# Altium schematic sheet ECG_mesurment.SchDoc
size 594 x 420 mm; SheetNumber: 2; SheetTotal: 4
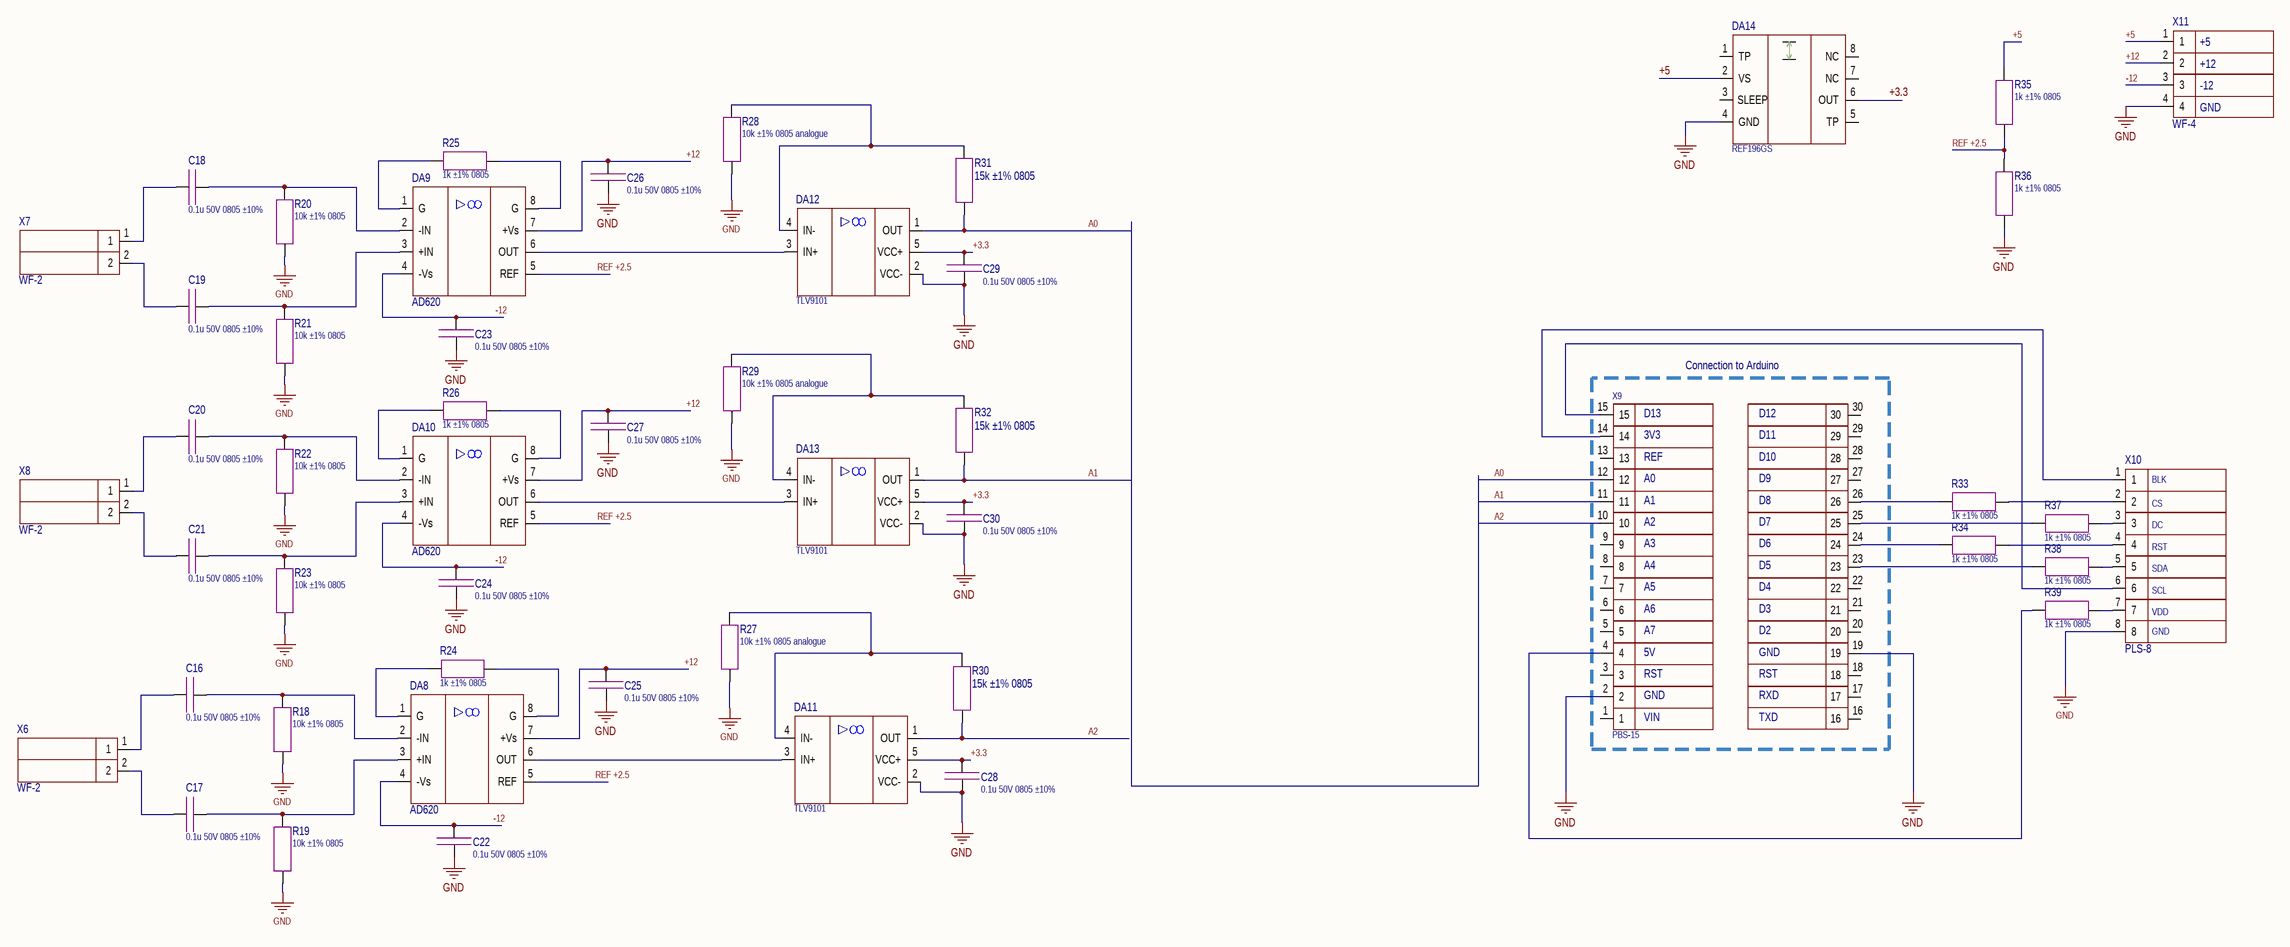
[diagram p0: ECG_mesurment.SchDoc]

## Parts
C16  0.1u 50V 0805 ±10%  [CAP: SMD 0805 MD IPC 782]
C17  0.1u 50V 0805 ±10%  [CAP: SMD 0805 MD IPC 782]
C18  0.1u 50V 0805 ±10%  [CAP: SMD 0805 MD IPC 782]
C19  0.1u 50V 0805 ±10%  [CAP: SMD 0805 MD IPC 782]
C20  0.1u 50V 0805 ±10%  [CAP: SMD 0805 MD IPC 782]
C21  0.1u 50V 0805 ±10%  [CAP: SMD 0805 MD IPC 782]
C22  0.1u 50V 0805 ±10%  [CAP: SMD 0805 MD IPC 782]
C23  0.1u 50V 0805 ±10%  [CAP: SMD 0805 MD IPC 782]
C24  0.1u 50V 0805 ±10%  [CAP: SMD 0805 MD IPC 782]
C25  0.1u 50V 0805 ±10%  [CAP: SMD 0805 MD IPC 782]
C26  0.1u 50V 0805 ±10%  [CAP: SMD 0805 MD IPC 782]
C27  0.1u 50V 0805 ±10%  [CAP: SMD 0805 MD IPC 782]
C28  0.1u 50V 0805 ±10%  [CAP: SMD 0805 MD IPC 782]
C29  0.1u 50V 0805 ±10%  [CAP: SMD 0805 MD IPC 782]
C30  0.1u 50V 0805 ±10%  [CAP: SMD 0805 MD IPC 782]
DA8  AD620  [IC: SOIC 8]
DA9  AD620  [IC: SOIC 8]
DA10  AD620  [IC: SOIC 8]
DA11  TLV9101  [IC: SOT 23 5pin]
DA12  TLV9101  [IC: SOT 23 5pin]
DA13  TLV9101  [IC: SOT 23 5pin]
DA14  REF196GS  [IC: SOIC 8]
R18  10k ±1% 0805  [RES: SMD 0805 MD IPC 782]
R19  10k ±1% 0805  [RES: SMD 0805 MD IPC 782]
R20  10k ±1% 0805  [RES: SMD 0805 MD IPC 782]
R21  10k ±1% 0805  [RES: SMD 0805 MD IPC 782]
R22  10k ±1% 0805  [RES: SMD 0805 MD IPC 782]
R23  10k ±1% 0805  [RES: SMD 0805 MD IPC 782]
R24  1k ±1% 0805  [RES: SMD 0805 MD IPC 782]
R25  1k ±1% 0805  [RES: SMD 0805 MD IPC 782]
R26  1k ±1% 0805  [RES: SMD 0805 MD IPC 782]
R27  10k ±1% 0805 analogue  [RES: SMD 0805 MD IPC 782]
R28  10k ±1% 0805 analogue  [RES: SMD 0805 MD IPC 782]
R29  10k ±1% 0805 analogue  [RES: SMD 0805 MD IPC 782]
R30  15k ±1% 0805  [RES: SMD 0805 MD IPC 782]
R31  15k ±1% 0805  [RES: SMD 0805 MD IPC 782]
R32  15k ±1% 0805  [RES: SMD 0805 MD IPC 782]
R33  1k ±1% 0805  [RES: SMD 0805 MD IPC 782]
R34  1k ±1% 0805  [RES: SMD 0805 MD IPC 782]
R35  1k ±1% 0805  [RES: SMD 0805 MD IPC 782]
R36  1k ±1% 0805  [RES: SMD 0805 MD IPC 782]
R37  1k ±1% 0805  [RES: SMD 0805 MD IPC 782]
R38  1k ±1% 0805  [RES: SMD 0805 MD IPC 782]
R39  1k ±1% 0805  [RES: SMD 0805 MD IPC 782]
X6  WF-2  [CON: 2pin wf-2]
X7  WF-2  [CON: 2pin wf-2]
X8  WF-2  [CON: 2pin wf-2]
X9  PBS-15  [CON: 15PIN PBS-15 double]
X10  PLS-8  [CON: 8PIN PLS-8]
X11  WF-4  [CON: 4pin wf-4]

## Nets
GND: C22.2 C23.2 C24.2 C25.2 C26.2 C27.2 C28.2 C29.2 C30.2 DA11.2(VCC-) DA12.2(VCC-) DA13.2(VCC-) DA14.4(GND) R18.1 R19.1 R20.1 R21.1 R22.1 R23.1 R27.1 R28.1 R29.1 R36.1 X9.2 X9.19 X10.8 X11.4
+3.3: C28.1 C29.1 C30.1 DA11.5(VCC+) DA12.5(VCC+) DA13.5(VCC+) DA14.6(OUT)
+5: DA14.2(VS) R35.2 X11.1
+12: C25.1 C26.1 C27.1 DA8.7(+Vs) DA9.7(+Vs) DA10.7(+Vs) X11.2
-12: C22.1 C23.1 C24.1 DA8.4(-Vs) DA9.4(-Vs) DA10.4(-Vs) X11.3
A0: DA12.1(OUT) R31.2 X9.12
A1: DA13.1(OUT) R32.2 X9.11
A2: DA11.1(OUT) R30.2 X9.10
REF +2.5: DA8.5(REF) DA9.5(REF) DA10.5(REF) R35.1 R36.2
NetC16_1: C16.1 DA8.2(-IN) R18.2
NetC16_2: C16.2 X6.1
NetC17_1: C17.1 DA8.3(+IN) R19.2
NetC17_2: C17.2 X6.2
NetC18_1: C18.1 DA9.2(-IN) R20.2
NetC18_2: C18.2 X7.1
NetC19_1: C19.1 DA9.3(+IN) R21.2
NetC19_2: C19.2 X7.2
NetC20_1: C20.1 DA10.2(-IN) R22.2
NetC20_2: C20.2 X8.1
NetC21_1: C21.1 DA10.3(+IN) R23.2
NetC21_2: C21.2 X8.2
NetDA8_1: DA8.1(G) R24.1
NetDA8_6: DA8.6(OUT) DA11.3(IN+)
NetDA8_8: DA8.8(G) R24.2
NetDA9_1: DA9.1(G) R25.1
NetDA9_6: DA9.6(OUT) DA12.3(IN+)
NetDA9_8: DA9.8(G) R25.2
NetDA10_1: DA10.1(G) R26.1
NetDA10_6: DA10.6(OUT) DA13.3(IN+)
NetDA10_8: DA10.8(G) R26.2
NetDA11_4: DA11.4(IN-) R27.2 R30.1
NetDA12_4: DA12.4(IN-) R28.2 R31.1
NetDA13_4: DA13.4(IN-) R29.2 R32.1
NetR33_1: R33.1 X9.26
NetR33_2: R33.2 X10.2
NetR34_1: R34.1 X9.24
NetR34_2: R34.2 X10.4
NetR37_1: R37.1 X9.25
NetR37_2: R37.2 X10.3
NetR38_1: R38.1 X9.23
NetR38_2: R38.2 X10.5
NetR39_1: R39.1 X9.4
NetR39_2: R39.2 X10.7
NetX9_14: X9.14 X10.1
NetX9_15: X9.15 X10.6

Not connected (* = marked no-connect by the designer): DA14 1(TP) 3(SLEEP) 5(TP) 7(NC) 8(NC); X9 1 3 5 6 7 8 9 13 16 17 18 20 21 22 27 28 29 30

## Notes on the sheet
- (near X11) +12
- (near X11) +5
- (near X11) GND
- (near X11) -12
- (near X9) Connection to Arduino
- (near X9) D13
- (near X9) 3V3
- (near X9) REF
- (near X9) D12
- (near X9) D11
- (near X9) D10
- (near X9) A0
- (near X9) A1
- (near X9) D9
- (near X9) D8
- (near X10) BLK
- (near X10) CS
- (near X9) A2
- (near X9) A3
- (near X9) A4
- (near X9) D7
- (near X9) D6
- (near X9) D5
- (near X10) DC
- (near X10) RST
- (near X9) A5
- (near X9) A6
- (near X9) D4
- (near X9) D3
- (near X10) SDA
- (near X10) SCL
- (near X10) VDD
- (near X9) A7
- (near X9) 5V
- (near X9) RST
- (near X9) D2
- (near X9) GND
- (near X10) GND
- (near X9) VIN
- (near X9) RXD
- (near X9) TXD
- Перв. примен.
- Справ. №
- Подп. и дата
- Инв. № дубл.
- Взам. инв. №
- Разраб.
- Изм.
- Лист
- № докум.
- Подп.
- Дата
- Лит.
- Масса
- Масштаб
- Пров.
- Т.контр.
- Листов
- Инв. № подл.
- Утв.
- Н.контр.
- 2.106-A2
- Копировал
- Формат А2

## Library data of the parts
C16-C30 = 0.1u 50V 0805 ±10%: Code: 6279254871; Name: Конденсатор X7R 50V 0,1uF ±10% 0805
DA11-DA13 = TLV9101: Code: 6339115821; Name: Микросхема TLV9101IDBVR
DA14 = REF 3.3V: Code: 6335601961; Name: Микросхема REF196GS, AD
R18-R23 = 10k ±1% 0805: Code: 6020003061; Name: Резистор RC0805JR-0710KL
R24-R26 R33-R39 = 1k ±1% 0805: Code: 6027158691; Name: Резистор RC0805FR-071KL, Yageo
R27-R29 = 10k ±1% 0805 analogue: Code: 6094357511; Name: Резистор 10K±1% 0805
R30-R32 = 15k ±1% 0805: Code: 6027162091; Name: Резистор RT0805FRE1015KL, Yageo
X6-X8 = 2 pin WF-2: Code: 6313952902; Name: Вилка WF-2
X9 = 15 pin PBS 15 Double
X10 = 8 pin PLS 8
X11 = 4 pin WF-4: Code: 6313932041; Name: Вилка WF-4